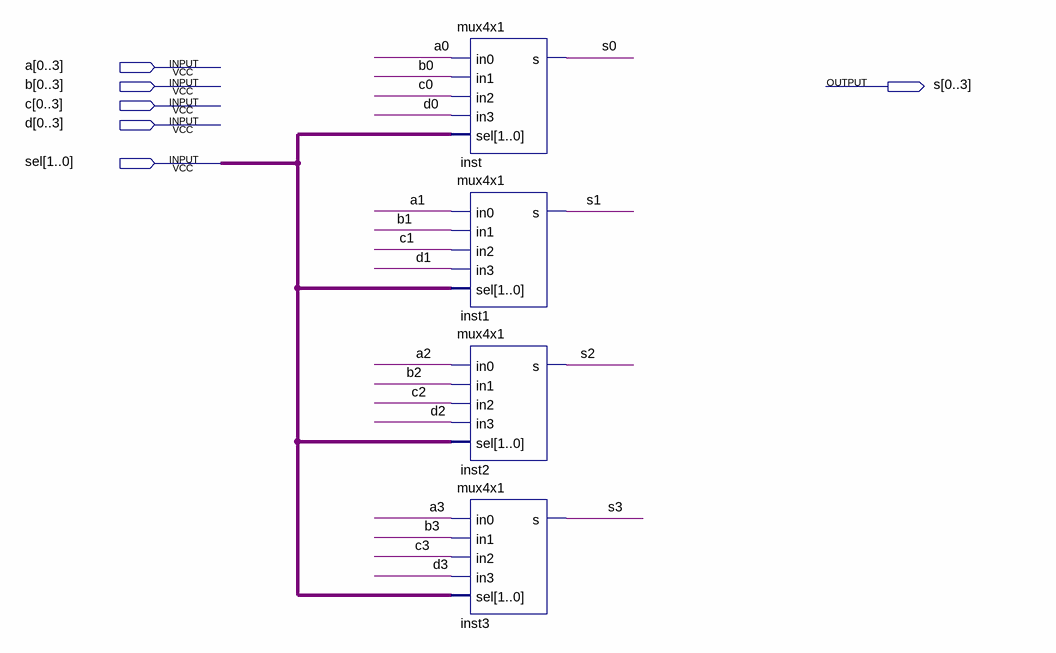
[diagram p0: schematic sheet]
// Quartus schematic mux4bits4x1.bdf as structural Verilog: 4 symbols, 6 pins
module mux4bits4x1 (
  input  [0:3] a,
  input  [0:3] b,
  input  [0:3] c,
  input  [0:3] d,
  input  [1:0] sel,
  output [0:3] s
);

  mux4x1 inst (.in0(a[0]), .in1(b[0]), .in2(c[0]), .in3(d[0]), .sel(sel), .s(s[0]));
  mux4x1 inst1 (.in0(a[1]), .in1(b[1]), .in2(c[1]), .in3(d[1]), .sel(sel), .s(s[1]));
  mux4x1 inst2 (.in0(a[2]), .in1(b[2]), .in2(c[2]), .in3(d[2]), .sel(sel), .s(s[2]));
  mux4x1 inst3 (.in0(a[3]), .in1(b[3]), .in2(c[3]), .in3(d[3]), .sel(sel), .s(s[3]));
endmodule
